# EAGLE design fetboard (EAGLE 6.2)
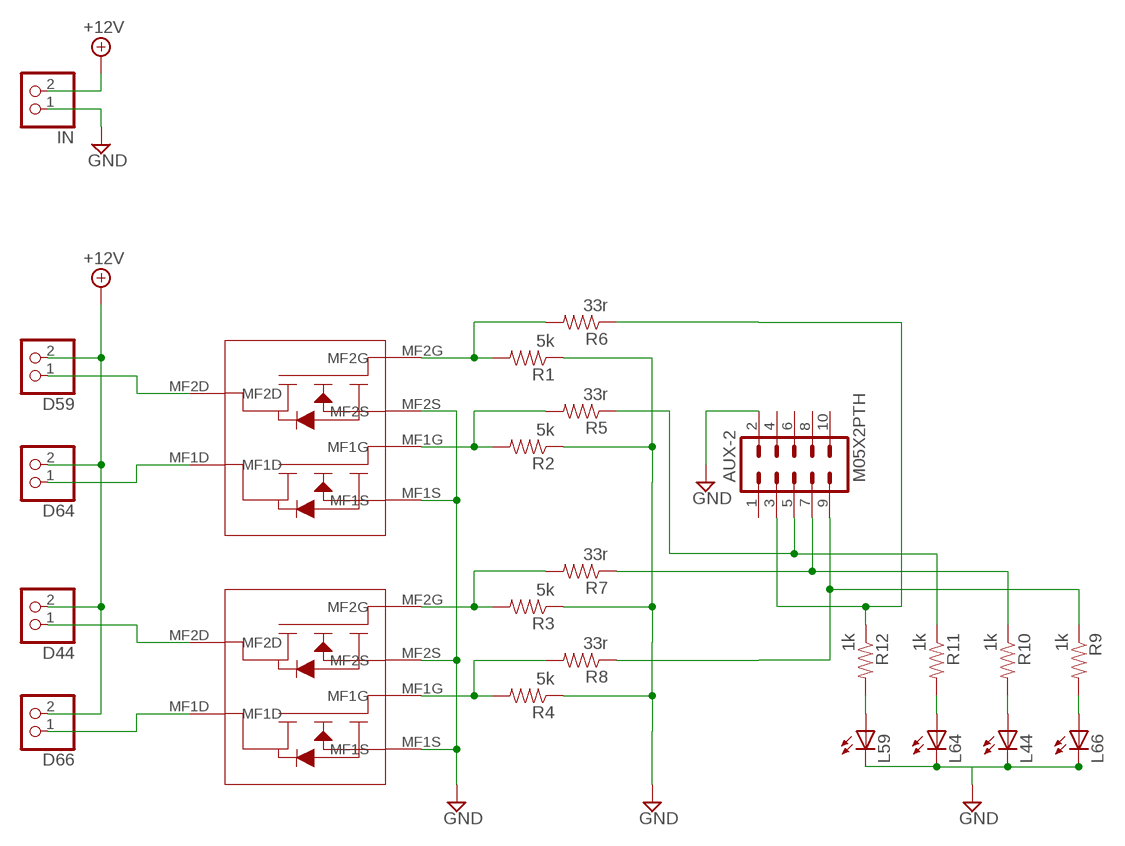
[diagram p0: schematic, sheet 1]

## Parts
AUX-2  M05X2PTH  [AVR_ICSP]
D44  PINHD-1X2  [1X02]
D59  PINHD-1X2  [1X02]
D64  PINHD-1X2  [1X02]
D66  PINHD-1X2  [1X02]
FET1  IPG20N04S4L-11  [SUPERSO8]
FET2  IPG20N04S4L-11  [SUPERSO8]
IN  PINHD-1X2  [1X02]
L44  LEDCHIPLED_0805  [CHIPLED_0805]
L59  LEDCHIPLED_0805  [CHIPLED_0805]
L64  LEDCHIPLED_0805  [CHIPLED_0805]
L66  LEDCHIPLED_0805  [CHIPLED_0805]
R1  5k  RESISTOR0805-RES  [0805]
R2  5k  RESISTOR0805-RES  [0805]
R3  5k  RESISTOR0805-RES  [0805]
R4  5k  RESISTOR0805-RES  [0805]
R5  33r  RESISTOR0805-RES  [0805]
R6  33r  RESISTOR0805-RES  [0805]
R7  33r  RESISTOR0805-RES  [0805]
R8  33r  RESISTOR0805-RES  [0805]
R9  1k  RESISTOR0805-RES  [0805]
R10  1k  RESISTOR0805-RES  [0805]
R11  1k  RESISTOR0805-RES  [0805]
R12  1k  RESISTOR0805-RES  [0805]

## Nets
+12V: D44.2 D59.2 D64.2 D66.2 IN.2
GND: AUX-2.2 FET1.MF1S FET1.MF2S FET2.MF1S FET2.MF2S IN.1 L44.C L59.C L64.C L66.C R1.1 R2.1 R3.1 R4.1
N$1: AUX-2.3 R6.1 R12.1
N$2: FET1.MF1G R2.2 R5.2
N$3: L59.A R12.2
N$4: FET2.MF1G R4.2 R8.2
N$5: FET2.MF2G R3.2 R7.2
N$6: FET1.MF2G R1.2 R6.2
N$7: AUX-2.7 R7.1 R10.1
N$8: AUX-2.9 R8.1 R9.1
N$9: AUX-2.5 R5.1 R11.1
N$10: L64.A R11.2
N$11: L44.A R10.2
N$12: L66.A R9.2
N$13: D64.1 FET1.MF1D
N$14 [power]: D44.1 FET2.MF2D
N$15 [power]: D66.1 FET2.MF1D
N$16: D59.1 FET1.MF2D
Unconnected: AUX-2.1 AUX-2.4 AUX-2.6 AUX-2.8 AUX-2.10

## Library data of the parts
AUX-2 = SparkFun:M05X2: Header 5x2 Standard 10-pin dual row 0.1" header. Commonly used with AVR-ISP. Use with Spark Fun Electronics SKU: PRT-00778
D44 D59 D64 D66 IN = pinhead:PINHD-1X2: PIN HEADER
FET1 FET2 = 4pi:IPG20N04S4L-11
L44 L59 L64 L66 = adafruit:LED: LED OSRAM: - CHIPLED LG R971, LG N971, LY N971, LG Q971, LY Q971, LO R971, LY R971 LH N974, LH R974 LS Q976, LO Q976, LY Q976 LO Q996 - Hyper CHIPLED LW Q18S LB Q993, LB Q99A, LB R99A - SideLED LS A670, LO A670, LY A670, LG A670, LP A670 LB A673, LV A673, LT A673, LW A673 LH A674 LY A675 LS A676, LA A676, LO A676, LY A676, LW A676 LS A679, LY A679, LG A679 - Hyper Micro SIDELED® LS Y876, LA Y876, LO Y876, LY Y876 LT Y87S - SmartLED LW L88C, LW L88S LB L89C, LB L89S, LG L890 LS L89K, LO L89K, LY L89K LS L896, LA L896, LO L896, LY L896 - TOPLED LS T670, LO T670, LY T670, LG T670, LP T670 LSG T670, LSP T670, LSY T670, LOP T670, LYG T670 LG T671, LOG T671, LSG T671 LB T673, LV T673, LT T673, LW T673 LH T674 LS T676, LA T676, LO T676, LY T676, LB T676, LH T676, LSB T676, LW T676 LB T67C, LV T67C, LT T67C, LS T67K, LO T67K, LY T67K, LW E67C LS E67B, LA E67B, LO E67B, LY E67B, LB E67C, LV E67C, LT E67C LW T67C LS T679, LY T679, LG T679 LS T770, LO T770, LY T770, LG T770, LP T770 LB T773, LV T773, LT T773, LW T773 LH T774 LS E675, LA E675, LY E675, LS T675 LS T776, LA T776, LO T776, LY T776, LB T776 LHGB T686 LT T68C, LB T68C - Hyper Mini TOPLED® LB M676 - Mini TOPLED Santana® LG M470 LS M47K, LO M47K, LY M47K Source: http://www.osram.convergy.de/
R1-R12 = SparkFun:RESISTOR: Resistor Basic schematic elements and footprints for 0603, 1206, and PTH resistors.

## Net classes
0 default: width 0.305 mm
1 power: width 0.635 mm

## Board
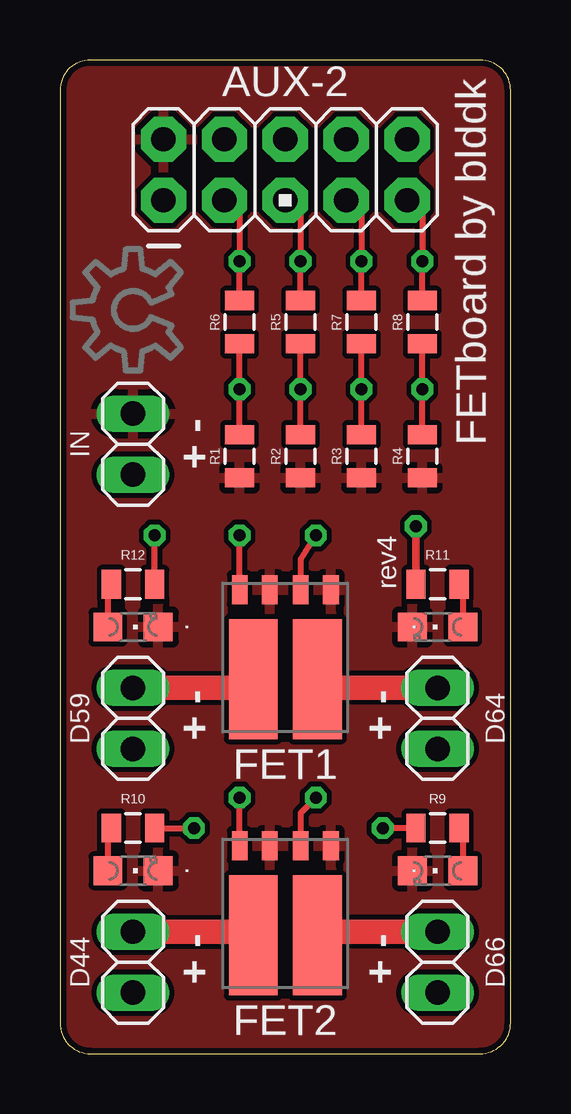
[diagram p1: board, top side]
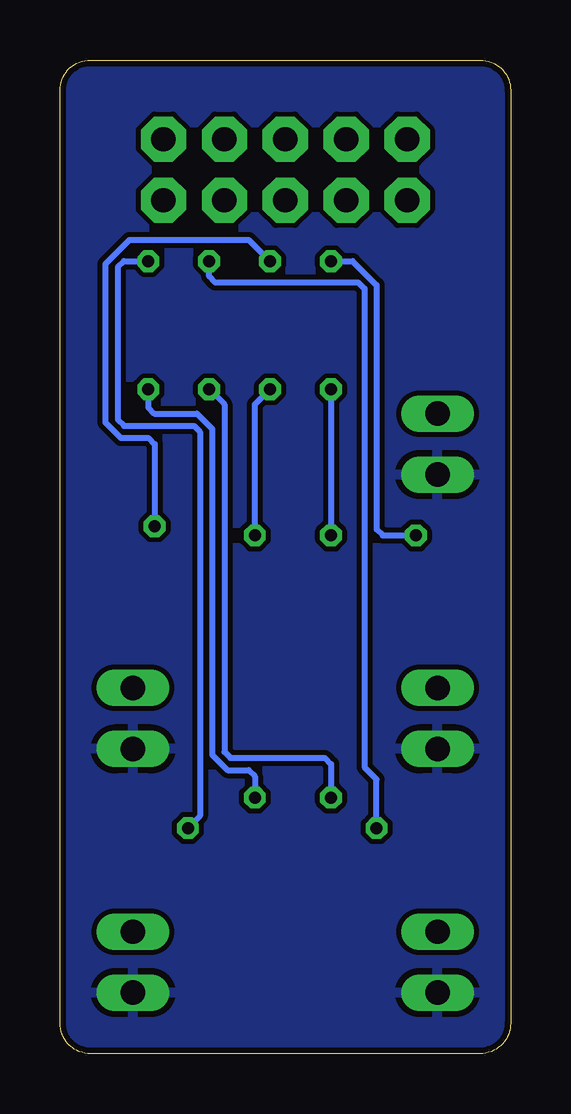
[diagram p2: board, bottom side, seen from below]

Size 18.8 x 41.4 mm. Coordinates in mm from the lower left corner, seen from the top.
Outline: 0,40.13 0,1.27 arc90 1.27,0 17.53,0 arc90 18.8,1.27 18.8,40.13 arc90 17.53,41.4 1.27,41.4 arc90 0,40.13
Copper layers (1*16): Top 0.035mm / dielectric 1.5mm / Bottom 0.035mm
Design rules "default": minimum track width 10mil, minimum drill 24mil, track to track 8mil, track to pad 8mil, pad to pad 8mil, via to via 8mil, smd to smd 8mil, copper to edge 10mil, drill to drill 8mil, minimum pad ring 10mil, minimum via ring 8mil, stop-mask expansion 4mil, vias tented up to drill 0mil, thermal gap 10mil

### Footprints (pad centres in the part's own frame; a part is rotated, then mirrored left to right if it is on the bottom)
AVR_ICSP = drill 1.016 pad 1.88 octagon: 1 -1.27,5.08; 2 1.27,5.08; 3 -1.27,2.54; 4 1.27,2.54; 5 -1.27,0; 6 1.27,0; 7 -1.27,-2.54; 8 1.27,-2.54; 9 -1.27,-5.08; 10 1.27,-5.08
1X02 = drill 1.016 long: 1 -1.27,0; 2 1.27,0
SUPERSO8 = smd 2.035 x 5: MF1D -1.335,0.91; MF2D 1.335,0.91 | smd 0.65 x 1.2: MF1G -0.645,-2.825; MF1S -1.905,-2.825; MF2G 1.905,-2.825; MF2S 0.645,-2.825
CHIPLED_0805 = smd 1.2 x 1.2: A 0,-1.05; C 0,1.05
0805 = smd 0.8 x 1.2: 1 -0.9,0; 2 0.9,0

### Placement (x,y rotation side)
AUX-2  9.4,36.83 90 top
D44  3.05,3.81 270 top
D59  3.05,13.97 270 top
D64  15.75,13.97 270 top
D66  15.75,3.81 270 top
FET1  9.4,16.51 180 top
FET2  9.4,5.84 180 top
IN  3.05,25.4 270 top
L44  3.05,7.62 270 top
L59  3.05,17.78 270 top
L64  15.75,17.78 90 top
L66  15.75,7.62 90 top
R1  7.49,24.89 90 top
R2  10.03,24.89 90 top
R3  12.57,24.89 90 top
R4  15.11,24.89 90 top
R5  10.03,30.48 270 top
R6  7.49,30.48 270 top
R7  12.57,30.48 270 top
R8  15.11,30.48 270 top
R9  15.75,9.4 0 top
R10  3.05,9.4 180 top
R11  15.75,19.56 0 top
R12  3.05,19.56 180 top
U$3  [OSHWLOGO_TOL_0.2]  3.05,30.99 90 top

### Tracks (layer width: path | path; a pad name or v marks a point on that pad's centre or on a via)
+12V
  pour Bottom: -2.03,43.18 22.1,43.18 22.1,-2.54 -2.03,-2.54
GND
  pour Top: -3.3,44.45 23.37,44.45 23.37,-3.81 -3.3,-3.81
N$1  (via drill 0.5)
  Top 0.254: R12.1 v3.95,21.59 | AUX-2.3 7.49,34.92 v7.49,33.02 R6.1
  Bottom 0.254: v7.49,33.02 6.59,33.02 5.59,32.02 5.59,21.84 5.33,21.59 v3.95,21.59
N$2  (via drill 0.5)
  Top 0.254: FET1.MF1G 10.04,20.61 v10.67,21.59 | R2.2 v10.03,27.69 R5.2
  Bottom 0.254: v10.67,21.59 10.67,27.05 v10.03,27.69
N$3
  Top 0.254: R12.2 2,19.05 L59.A
N$4  (via drill 0.5)
  Top 0.254: FET2.MF1G 10.04,10.03 v10.67,10.67 | R4.2 v15.11,27.69 R8.2
  Bottom 0.254: v15.11,27.69 15.11,26.92 14.86,26.67 13.08,26.67 12.45,26.04 12.45,24.13 12.45,12.45 11.81,11.81 10.92,11.81 10.67,11.56 v10.67,10.67
N$5  (via drill 0.5)
  Top 0.254: FET2.MF2G v7.49,10.67 | R3.2 v12.57,27.69 R7.2
  Bottom 0.254: v12.57,27.69 11.94,27.05 11.94,12.57 11.68,12.32 7.75,12.32 7.49,12.07 v7.49,10.67
N$6  (via drill 0.5)
  Top 0.254: FET1.MF2G v7.49,21.59 | R1.2 v7.49,27.69 R6.2
  Bottom 0.254: v7.49,27.69 v7.49,21.59
N$7  (via drill 0.5)
  Top 0.254: R10.1 v5.59,9.4 | AUX-2.7 12.57,34.92 v12.57,33.02 R7.1
  Bottom 0.254: v5.59,9.4 5.59,11.43 6.1,11.94 6.1,31.88 6.35,32.13 12.32,32.13 12.57,32.38 v12.57,33.02
N$8  (via drill 0.5)
  Top 0.254: R9.1 v13.46,9.4 | AUX-2.9 15.11,34.92 v15.11,33.02 R8.1
  Bottom 0.254: v13.46,9.4 12.95,9.91 12.95,25.91 13.21,26.16 16.13,26.16 16.38,26.42 16.38,32.77 16.13,33.02 v15.11,33.02
N$9  (via drill 0.5)
  Top 0.254: AUX-2.5 10.03,34.92 v10.03,33.02 R5.1
  Top 0.305: R11.1 v14.85,21.97
  Bottom 0.254: v10.03,33.02 10.92,33.91 15.89,33.91 16.89,32.91 16.89,26.29 16.26,25.65 15.1,25.65 14.85,25.4 v14.85,21.97
N$10
  Top 0.254: R11.2 16.8,19.05 L64.A
N$11
  Top 0.254: R10.2 2,8.89 L44.A
N$12
  Top 0.254: R9.2 16.8,8.89 L66.A
N$13
  Top 0.406: 11.37,15.24 FET1.MF1D
  Top 1.016: D64.1 11.37,15.24
N$14
  Top 0.406: 7.43,5.08 FET2.MF2D
  Top 1.016: D44.1 7.43,5.08
N$15
  Top 0.406: 11.37,5.08 FET2.MF1D
  Top 1.016: D66.1 11.37,5.08
N$16
  Top 0.406: 7.43,15.24 FET1.MF2D
  Top 1.016: D59.1 7.43,15.24

### Text on the board
tNames: FETboard by blddk | + - | rev4 | . | . | + - | + - | . | . | + - | + -